# EAGLE schematic adaptador (EAGLE 7.6.0)
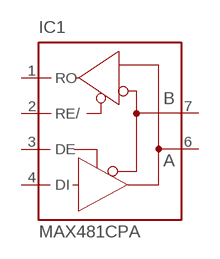
[diagram p0: schematic, sheet 1]

## Parts
IC1  MAX481CPA  [DIL08]
Unconnected: IC1.1(RO) IC1.2(RE/) IC1.3(DE) IC1.4(DI) IC1.6(A) IC1.7(B)

## Power pins joined to a net without a drawn wire
GND: IC1.5(GND)
VCC: IC1.8(VCC)

## Library data of the parts
IC1 = maxim:MAX481CPA: RS485 TRANSEIVER; MPN: MAX481CPA+; OC_FARNELL: unknown; OC_NEWARK: 99K3445